# EAGLE design tinyLIPO (EAGLE 9.3.2)
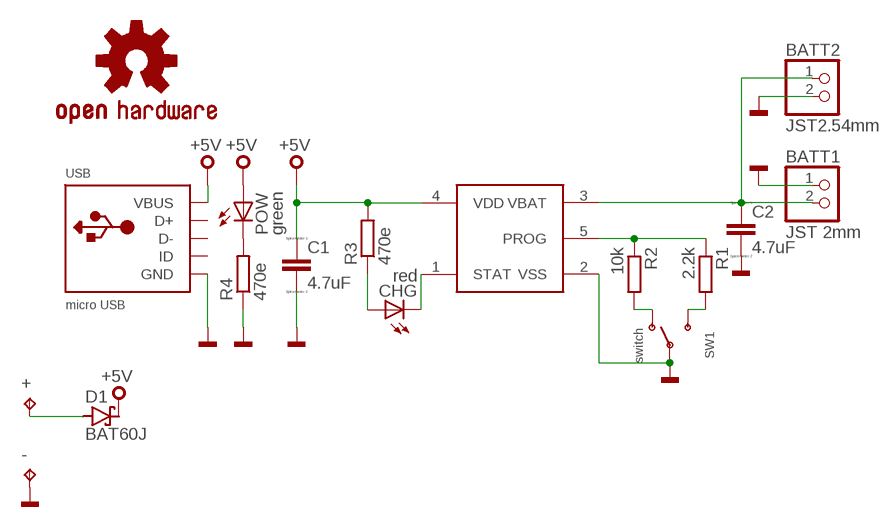
[diagram p0: schematic, sheet 1]

## Parts
+  TPTP20SQ  [TP20SQ]
-  TPTP20SQ  [TP20SQ]
BATT1  JST 2mm  JST_2PIN  [JSTPH2]
BATT2  JST2.54mm  HEADER-1X2  [1X02_OVAL]
C1  4.7uF  C-EUC0805  [C0805]
C2  4.7uF  C-EUC0805  [C0805]
CHG  red  LEDCHIPLED_0805  [CHIPLED_0805]
D1  BAT60J  [SOD323_ST]
IC1  MCP73831  [SOT23-5]
LOGO1  OSHW-LOGOM  [OSHW-LOGO-M]
POW  green  LEDCHIPLED_0805  [CHIPLED_0805]
R1  2.2k  R-EU_M0805  [M0805]
R2  10k  R-EU_M0805  [M0805]
R3  470e  R-EU_M0805  [M0805]
R4  470e  R-EU_M0805  [M0805]
SW1  switch  SWITCH_SPDT  [SPDT_SMT_SSSS811101]
USB  micro USB  USBMINIBLARGE  [USB-MINIB_LARGER]

## Nets
+5V: C1.1 D1.C IC1.4(VDD) POW.A R3.2 USB.VBUS
GND: -.TP BATT1.1 BATT2.2 C1.2 C2.2 IC1.2(VSS) R4.1 SW1.B(P) USB.GND
N$1: IC1.5(PROG) R1.1 R2.1
N$2: R1.2 SW1.C(S)
N$3: R2.2 SW1.A(O)
N$4: BATT1.2 BATT2.1 C2.1 IC1.3(VBAT)
N$5: CHG.A R3.1
N$6: CHG.C IC1.1(STAT)
N$7: POW.C R4.2
N$8: +.TP D1.A
Unconnected: USB.D+ USB.D- USB.ID

## Library data of the parts
+ - = testpad:TP: Test pad
BATT1 = microbuilder:JST_2PIN: JST 2-Pin Right-Angle Connector PH-Series - 4UConnector: 17311 SH-Series - 4UConnector: 07278
BATT2 = microbuilder:HEADER-1X2: PIN HEADER
C1 C2 = resistor:C-EU: CAPACITOR, European symbol; SPICEPREFIX: C
CHG POW = adafruit:LED: LED OSRAM: - CHIPLED LG R971, LG N971, LY N971, LG Q971, LY Q971, LO R971, LY R971 LH N974, LH R974 LS Q976, LO Q976, LY Q976 LO Q996 - Hyper CHIPLED LW Q18S LB Q993, LB Q99A, LB R99A - SideLED LS A670, LO A670, LY A670, LG A670, LP A670 LB A673, LV A673, LT A673, LW A673 LH A674 LY A675 LS A676, LA A676, LO A676, LY A676, LW A676 LS A679, LY A679, LG A679 - Hyper Micro SIDELED® LS Y876, LA Y876, LO Y876, LY Y876 LT Y87S - SmartLED LW L88C, LW L88S LB L89C, LB L89S, LG L890 LS L89K, LO L89K, LY L89K LS L896, LA L896, LO L896, LY L896 - TOPLED LS T670, LO T670, LY T670, LG T670, LP T670 LSG T670, LSP T670, LSY T670, LOP T670, LYG T670 LG T671, LOG T671, LSG T671 LB T673, LV T673, LT T673, LW T673 LH T674 LS T676, LA T676, LO T676, LY T676, LB T676, LH T676, LSB T676, LW T676 LB T67C, LV T67C, LT T67C, LS T67K, LO T67K, LY T67K, LW E67C LS E67B, LA E67B, LO E67B, LY E67B, LB E67C, LV E67C, LT E67C LW T67C LS T679, LY T679, LG T679 LS T770, LO T770, LY T770, LG T770, LP T770 LB T773, LV T773, LT T773, LW T773 LH T774 LS E675, LA E675, LY E675, LS T675 LS T776, LA T776, LO T776, LY T776, LB T776 LHGB T686 LT T68C, LB T68C - Hyper Mini TOPLED® LB M676 - Mini TOPLED Santana® LG M470 LS M47K, LO M47K, LY M47K Source: http://www.osram.convergy.de/
D1 = diode:BAT60J: Schottky barrier diode Source: www.st.com, BAT60J.pdf
IC1 = lipoLib:MCP73831
LOGO1 = SparkFun-Aesthetics:OSHW-LOGO: Open Source Hardware Logo This logo indicates the piece of hardware it is found on incorporates a OSHW license and/or adheres to the definition of open source hardware found here: http://freedomdefined.org/OSHW
R1-R4 = rcl:R-EU_: RESISTOR, European symbol
SW1 = microbuilder:SWITCH_SPDT: Switch - SPDT SSSS811101 - Horizontal Two Position SMT, 0.3A 4V [Mouser: 688-SSSS811101]
USB = microbuilder:USB: USB Connectors USBMINIB - Surface Mount Female Mini-B USB Connector 4UConnector: 06564

## Board
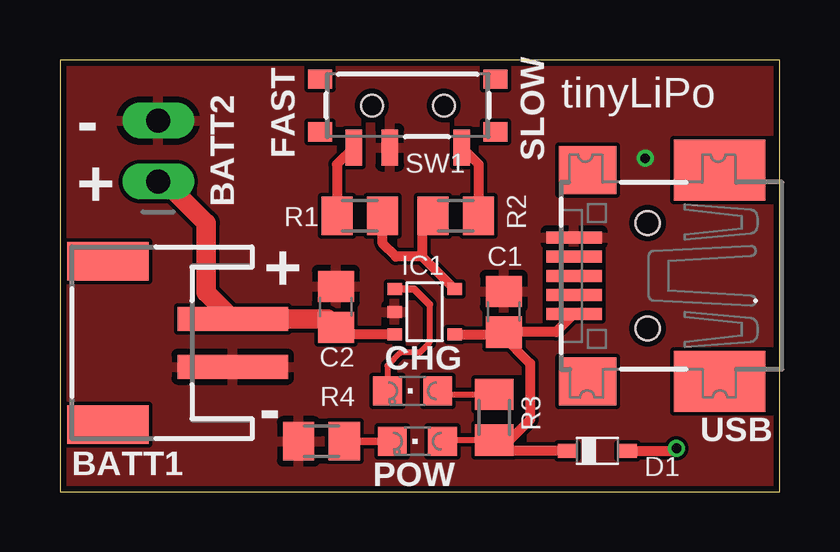
[diagram p1: board, top side]
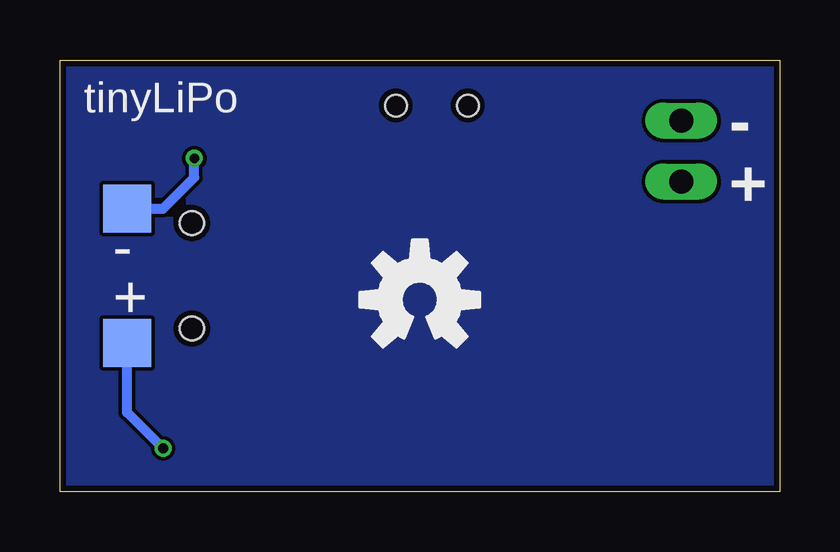
[diagram p2: board, bottom side, seen from below]

Size 30 x 18 mm. Coordinates in mm from the lower left corner, seen from the top.
Outline: 0,0 30,0 30,18 0,18 0,0
Copper layers (1*16): Top 0.035mm / dielectric 1.5mm / Bottom 0.035mm
Design rules "Fusion_eagle_rule_v1.1": minimum track width 6mil, minimum drill 12mil, track to track 6mil, track to pad 6mil, pad to pad 6mil, via to via 6mil, smd to smd 0mil, copper to edge 10mil, drill to drill 10mil, minimum pad ring 10mil, minimum via ring 6mil, stop-mask expansion 2mil, vias tented up to drill 100mil, thermal gap 10mil

### Footprints (pad centres in the part's own frame; a part is rotated, then mirrored left to right if it is on the bottom)
TP20SQ = smd 2 x 2: TP 0,0
JSTPH2 = smd 1 x 4.6: 1 -1,-3.7; 2 1,-3.7 | smd 1.6 x 3.4: NC1 -3.4,1.5; NC2 3.4,1.5
1X02_OVAL = drill 1 long: 1 -1.27,0; 2 1.27,0
C0805 = smd 1.3 x 1.5: 1 -0.85,0; 2 0.85,0
CHIPLED_0805 = smd 1.2 x 1.2: A 0,-1.05; C 0,1.05
SOD323_ST = smd 0.8 x 0.6: A 1.25,0; C -1.25,0
SOT23-5 = smd 0.5 x 0.6: 1 0.95,1.55; 2 0,1.55; 3 -0.95,1.55; 4 -0.95,-0.95; 5 0.95,-0.95
M0805 = smd 1.3 x 1.6: 1 -0.95,0; 2 0.95,0
SPDT_SMT_SSSS811101 = smd 0.7 x 1.5: A -2.25,1.75; B 0.75,1.75; C 2.25,1.75 | smd 1 x 0.8: SUP1 -3.65,1.1; SUP2 -3.65,-1.1; SUP3 3.65,1.1; SUP4 3.65,-1.1 | hole 0.9: -1.5,0; 1.5,0
USB-MINIB_LARGER = smd 0.5 x 2.308: D+ 0,4.064; D- -0.8,4.064; GND 1.6,4.064; ID 0.8,4.064; VBUS -1.6,4.064 | smd 2.54 x 3.81: GND1 -4.4,-2; GND4 4.4,-2 | smd 2 x 2.4: GND2 -4.4,3.5; GND3 4.4,3.5 | hole 1: -2.2,1; 2.2,1

### Placement (x,y rotation side)
+  27.2,6.2 0 bottom
-  27.2,11.8 0 bottom
BATT1  3.5,6.2 90 top
BATT2  4.1,14.2 90 top
C1  18.5,7.5 90 top
C2  11.5,7.7 90 top
CHG  14.7,4.2 90 top
D1  22.4,1.7 0 top
IC1  15.5,7.5 90 top
LOGO1  15,8 0 bottom
POW  14.9,2.1 90 top
R1  12.5,11.5 180 top
R2  16.5,11.5 0 top
R3  18.1,3.1 270 top
R4  10.9,2.1 0 top
SW1  14.5,16.1 180 top
USB  25.5,9 90 top

### Tracks (layer width: path | path; a pad name or v marks a point on that pad's centre or on a via)
+5V
  Top 0.254: POW.A 16,2.15 R3.2
  Top 0.406: USB.VBUS 20.69,6.65 C1.1 arc-90 18.4,6.55 | IC1.4 18.4,6.55 | 18.4,6.55 19.6,5.35 19.6,3 18.75,2.15 R3.2 18.1,1.7 D1.C
  pour Bottom: 0,0 30,0 30,18 0,18
GND  (via drill 0.4)
  Bottom 0.406: -.TP 25.7,11.8 24.4,13.1 v24.4,13.9
  pour Top: 0,18 30,18 30,0 0,0
N$1
  Top 0.406: IC1.5 15.1,9.8 | 15.1,9.8 14,9.8 13.45,10.35 R1.1 | R2.1 15.1,11.05 15.1,9.8
N$2
  Top 0.406: SW1.C 11.55,13.65 R1.2
N$3
  Top 0.406: SW1.A 17.45,13.65 R2.2
N$4
  Top 0.406: IC1.3 11.8,6.55 C2.1
  Top 0.813: C2.1 11.15,7.2 BATT1.2 6.1,8.3 6.1,11.2 4.37,12.93 BATT2.1
N$5
  Top 0.254: CHG.A 15.9,4.05 R3.1
N$6
  Top 0.254: 15.4,7.8 15.4,6.2 15,5.8 14.2,5.8 13.65,5.25 CHG.C
  Top 0.305: IC1.1 14.75,8.45 15.4,7.8
N$7
  Top 0.305: R4.2 POW.C
N$8  (via drill 0.4)
  Top 0.406: D1.A 25.6,1.7 v25.7,1.8
  Bottom 0.406: +.TP 27.2,3.3 v25.7,1.8

### Text on the board
tPlace: tinyLiPo | - | + | + | -
bPlace: tinyLiPo | - | +
tNames: FAST | SLOW